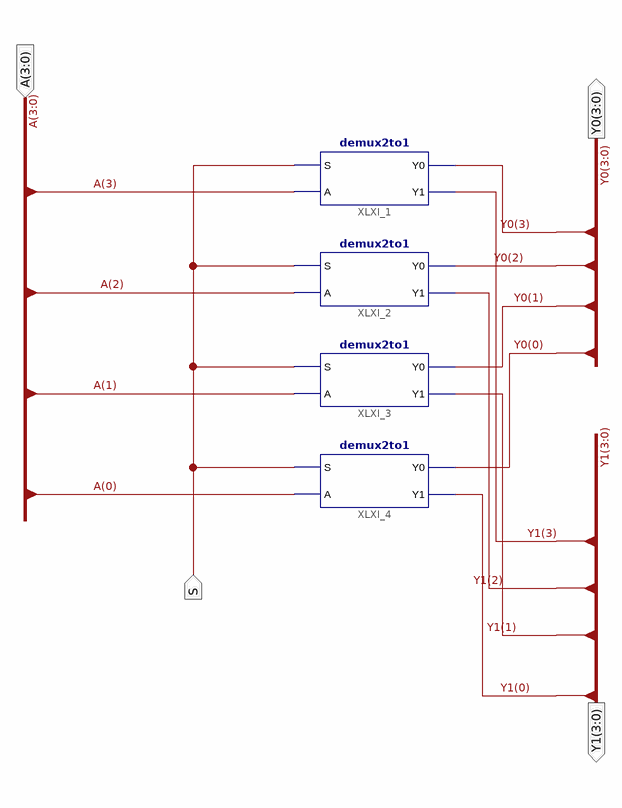
[diagram p0: schematic sheet 1]
// Xilinx ISE schematic demux4bit2to1.sch (spartan3e) as structural Verilog: 4 symbols, 4 ports
module demux4bit2to1 (
  input  [3:0] A,
  input  S,
  output [3:0] Y0,
  output [3:0] Y1
);

  demux2to1 XLXI_1 (.A(A[3]), .S(S), .Y0(Y0[3]), .Y1(Y1[3]));
  demux2to1 XLXI_2 (.A(A[2]), .S(S), .Y0(Y0[2]), .Y1(Y1[2]));
  demux2to1 XLXI_3 (.A(A[1]), .S(S), .Y0(Y0[1]), .Y1(Y1[1]));
  demux2to1 XLXI_4 (.A(A[0]), .S(S), .Y0(Y0[0]), .Y1(Y1[0]));
endmodule
